# EAGLE schematic eps (EAGLE 9.6.2)

## Sheet 1 of 8: PC104 Headers
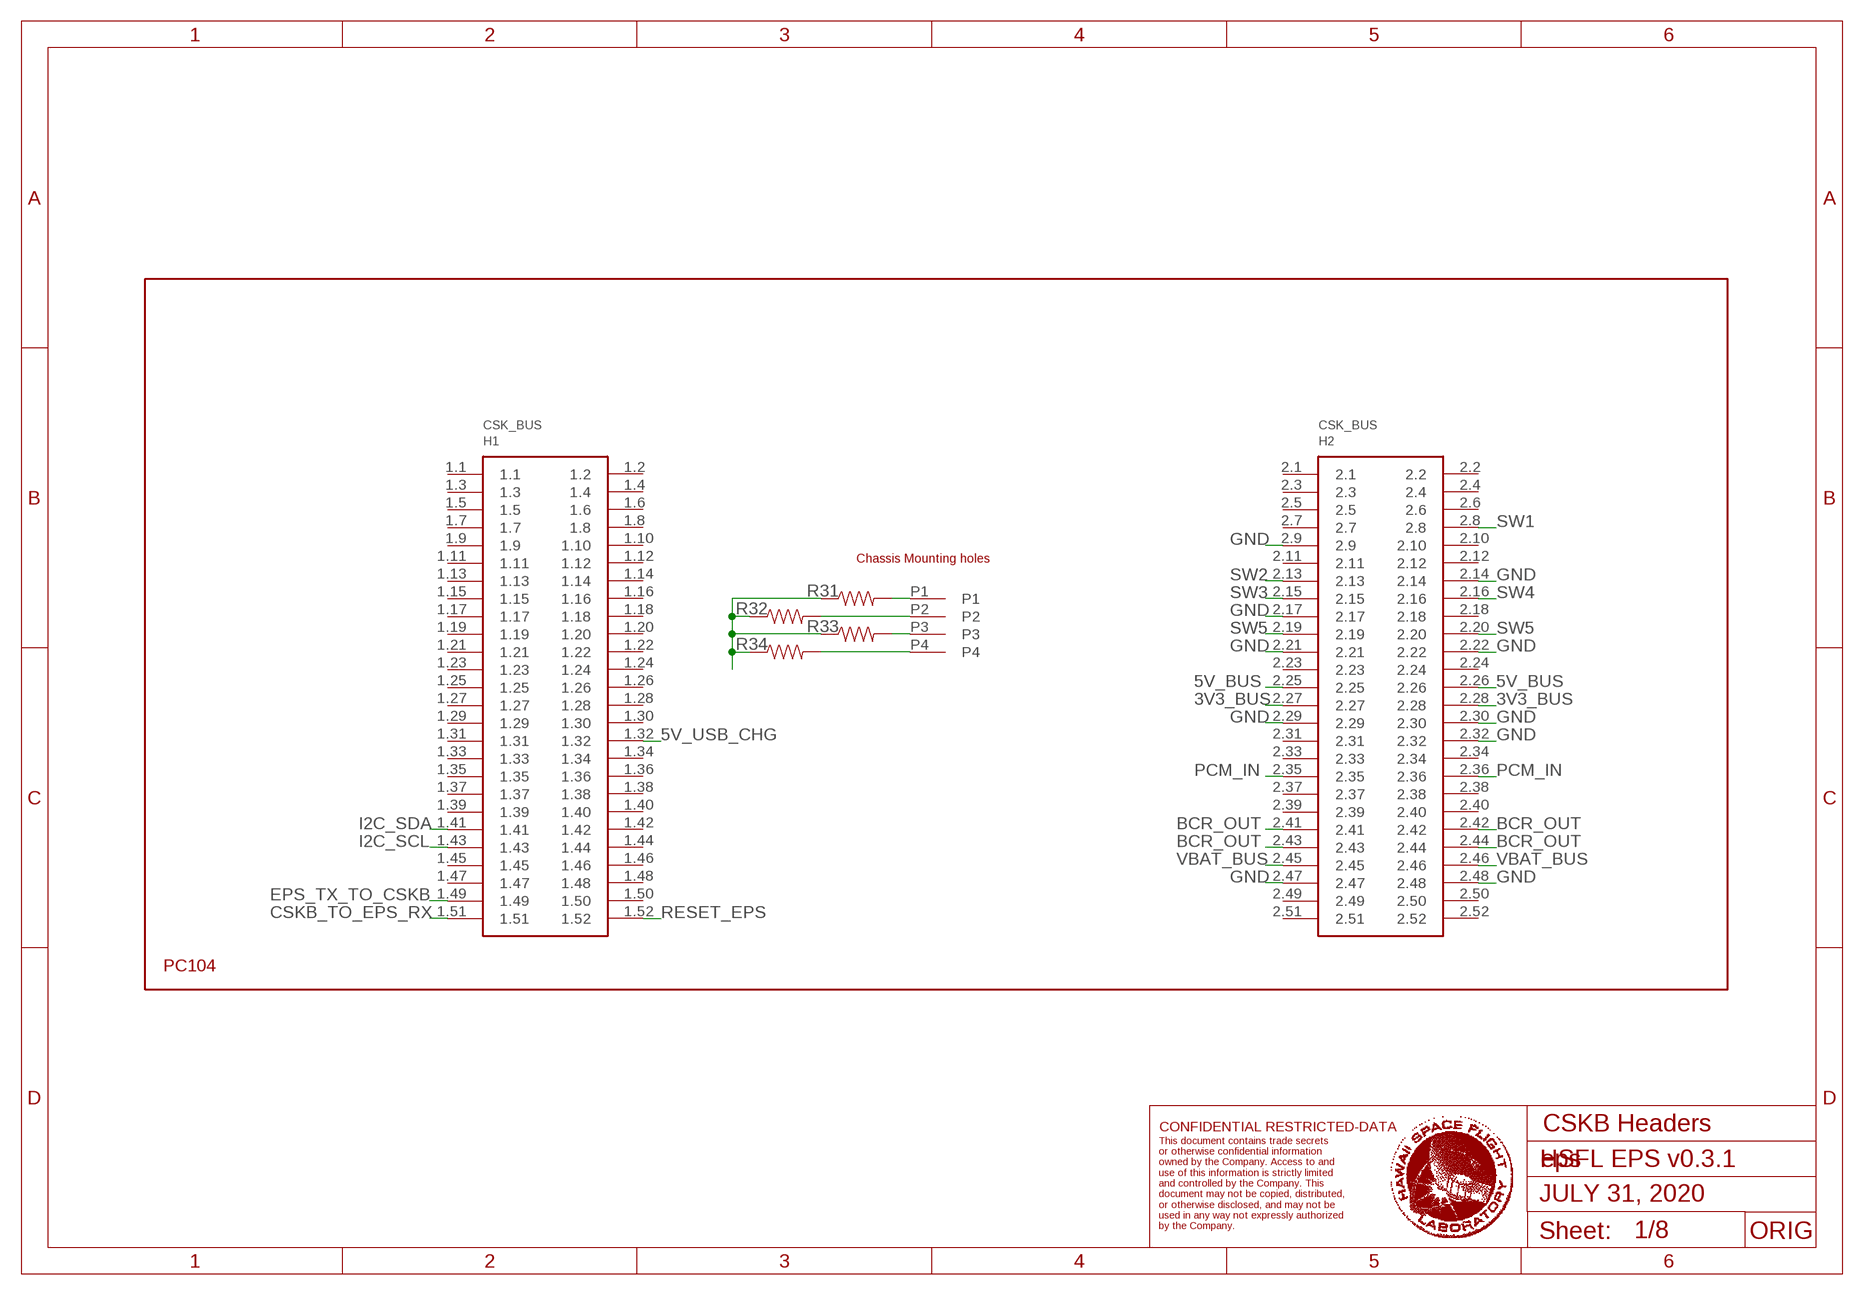
[diagram p0: schematic, sheet 1]

### Parts
H1  PC104_WCONN  [PC104_WCONN]
R31  1M  RESISTOR0805-RES  [0805]
R32  1M  RESISTOR0805-RES  [0805]
R33  1M  RESISTOR0805-RES  [0805]
R34  1M  RESISTOR0805-RES  [0805]

### Nets
3V3_BUS: H1.2.27 H1.2.28 ; also sheet 7,8
5V_BUS: H1.2.25 H1.2.26 ; also sheet 3,6,8
5V_USB_CHG: H1.1.32 ; also sheet 2
BCR_OUT: H1.2.41 H1.2.42 H1.2.43 H1.2.44 ; also sheet 2
CSKB_TO_EPS_RX: H1.1.51 ; also sheet 3
EPS_TX_TO_CSKB: H1.1.49 ; also sheet 3
GND: H1.2.9 H1.2.14 H1.2.17 H1.2.21 H1.2.22 H1.2.29 H1.2.30 H1.2.32 H1.2.47 H1.2.48 R31.1 R32.1 R33.1 R34.1 ; also sheet 2,3,4,5,6,7,8
I2C_SCL: H1.1.43 ; also sheet 3
I2C_SDA: H1.1.41 ; also sheet 3
P1_R31: H1.P1 R31.2
P2_R32: H1.P2 R32.2
P3_R33: H1.P3 R33.2
P4_R34: H1.P4 R34.2
PCM_IN: H1.2.35 H1.2.36 ; also sheet 4
RESET_EPS: H1.1.52 ; also sheet 3
SW1: H1.2.8 ; also sheet 5
SW2: H1.2.13 ; also sheet 8
SW3: H1.2.15 ; also sheet 8
SW4: H1.2.16 ; also sheet 8
SW5: H1.2.19 H1.2.20 ; also sheet 8
VBAT_BUS: H1.2.45 H1.2.46 ; also sheet 8
Unconnected: H1.1.1 H1.1.2 H1.1.3 H1.1.4 H1.1.5 H1.1.6 H1.1.7 H1.1.8 H1.1.9 H1.1.10 H1.1.11 H1.1.12 H1.1.13 H1.1.14 H1.1.15 H1.1.16 H1.1.17 H1.1.18 H1.1.19 H1.1.20 H1.1.21 H1.1.22 H1.1.23 H1.1.24 H1.1.25 H1.1.26 H1.1.27 H1.1.28 H1.1.29 H1.1.30 H1.1.31 H1.1.33 H1.1.34 H1.1.35 H1.1.36 H1.1.37 H1.1.38 H1.1.39 H1.1.40 H1.1.42 H1.1.44 H1.1.45 H1.1.46 H1.1.47 H1.1.48 H1.1.50 H1.2.1 H1.2.2 H1.2.3 H1.2.4 H1.2.5 H1.2.6 H1.2.7 H1.2.10 H1.2.11 H1.2.12 H1.2.18 H1.2.23 H1.2.24 H1.2.31 H1.2.33 H1.2.34 H1.2.37 H1.2.38 H1.2.39 H1.2.40 H1.2.49 H1.2.50 H1.2.51 H1.2.52

### Notes on the sheet
- CONFIDENTIAL RESTRICTED-DATA | CSKB Headers
- HSFL EPS v0.3.1
- JULY 31, 2020
- This document contains trade secrets 
  or otherwise confidential information 
  owned by the Company. Access to and 
  use of this information is strictly limited 
  and controlled by the Company. This 
  document may not be copied, distributed, 
  or otherwise disclosed, and may not be 
  used in any way not expressly authorized 
  by the Company.
- ORIG

## Sheet 2 of 8: BCR
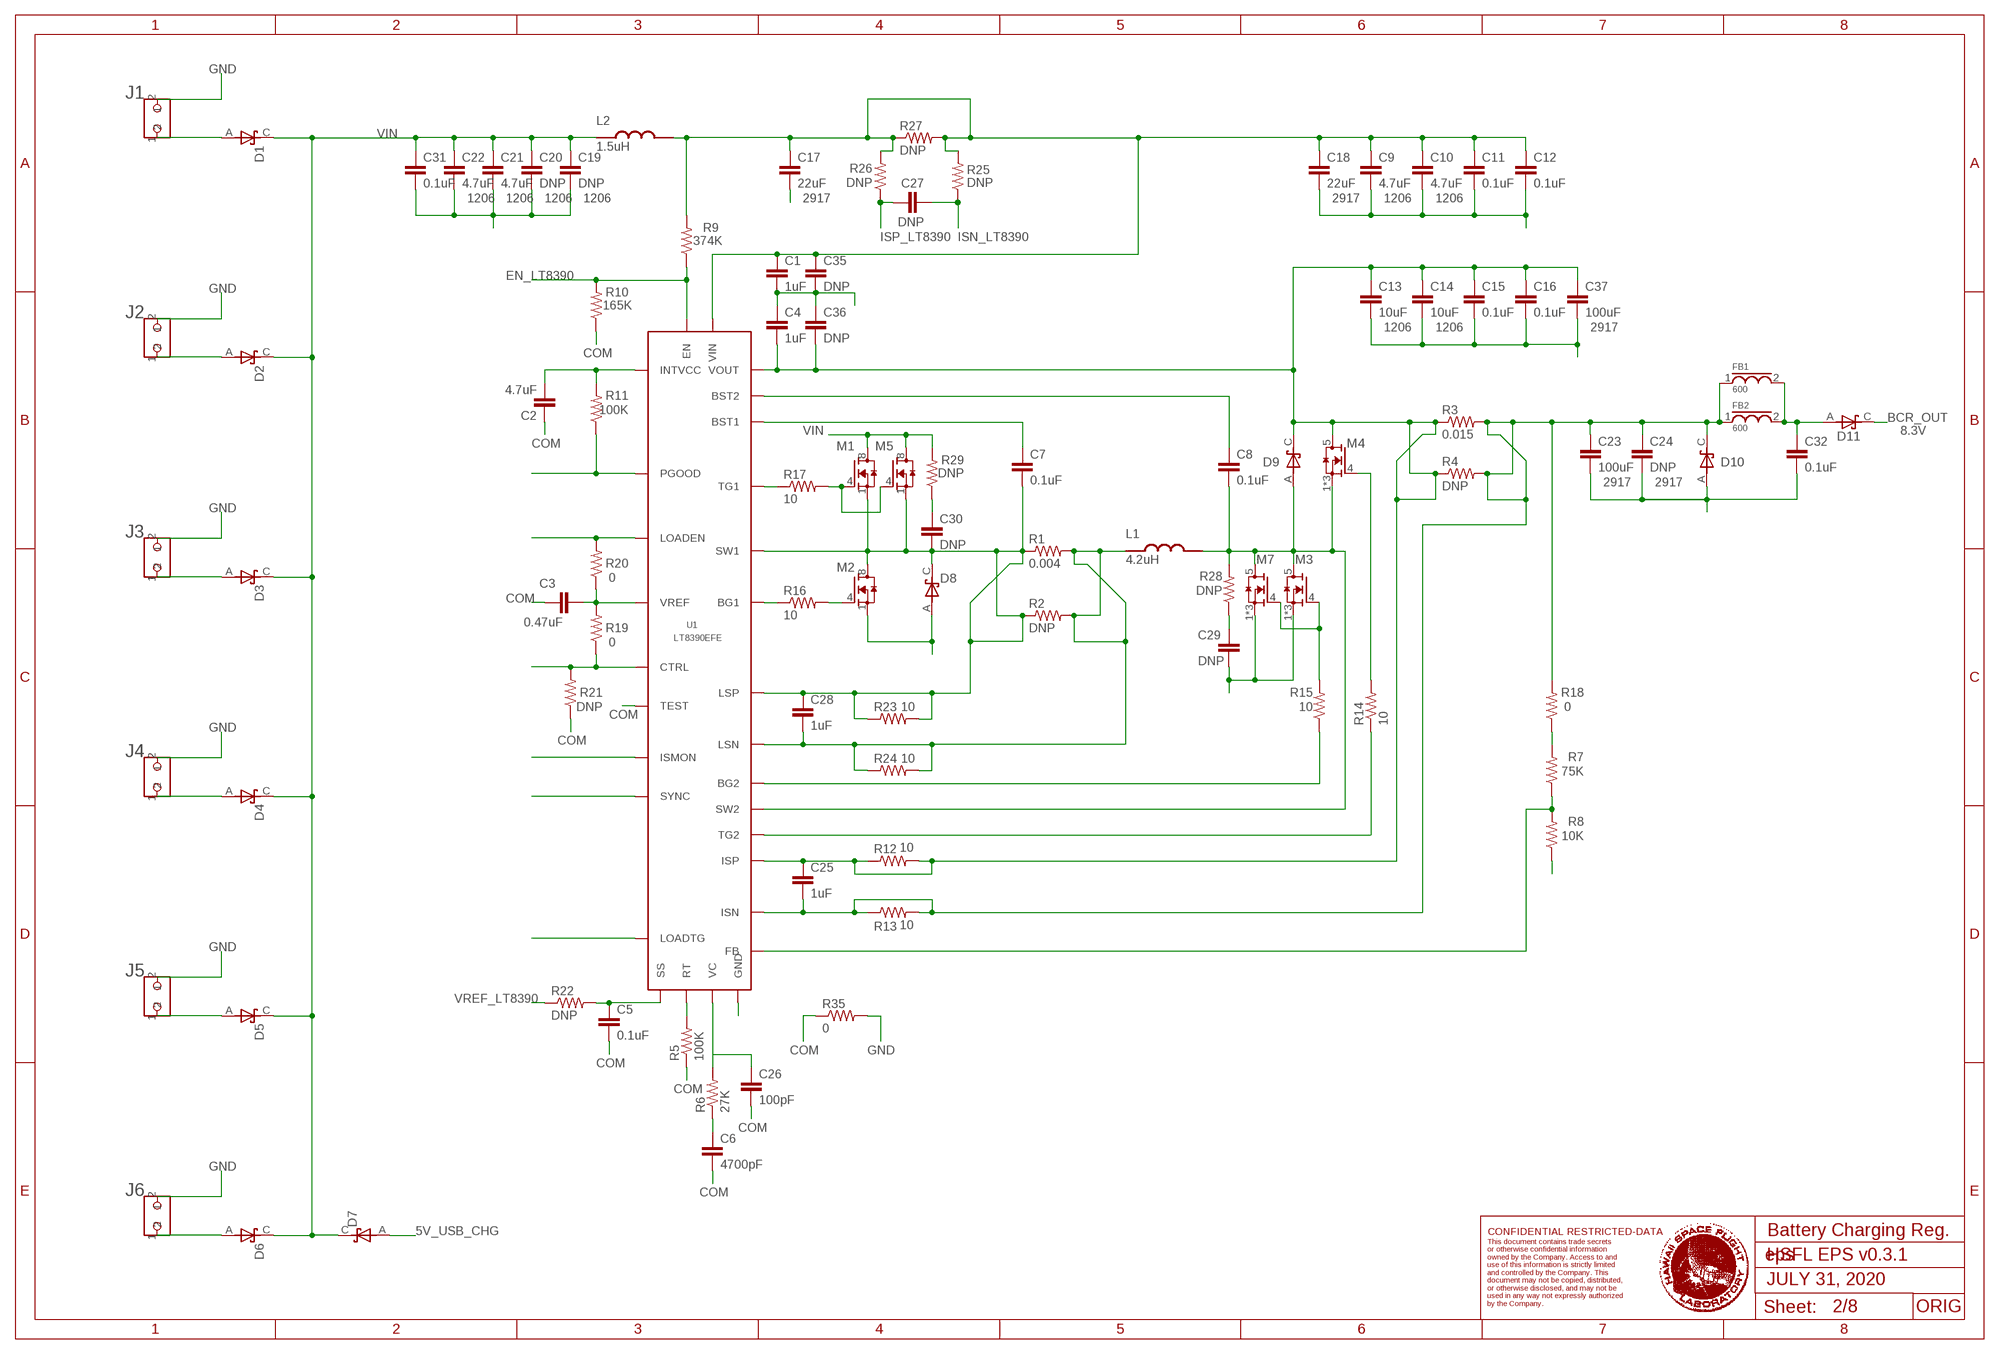
[diagram p1: schematic, sheet 2]

### Parts
C1  1uF  CAP0805  [0805]
C2  4.7uF  CAP0805  [0805]
C3  0.47uF  CAP0805  [0805]
C4  1uF  CAP0805  [0805]
C5  0.1uF  CAP0805  [0805]
C6  4700pF  CAP0805  [0805]
C7  0.1uF  CAP0805  [0805]
C8  0.1uF  CAP0805  [0805]
C9  4.7uF  CAP1206  [1206]
C10  4.7uF  CAP1206  [1206]
C11  0.1uF  CAP0805  [0805]
C12  0.1uF  CAP0805  [0805]
C13  10uF  CAP1206  [1206]
C14  10uF  CAP1206  [1206]
C15  0.1uF  CAP1210  [1210]
C16  0.1uF  CAP1210  [1210]
C17  22uF  CAP_29172917  [CAPMP7343X430N]
C18  22uF  CAP_29172917  [CAPMP7343X430N]
C19  DNP  CAP1206  [1206]
C20  DNP  CAP1206  [1206]
C21  4.7uF  CAP1206  [1206]
C22  4.7uF  CAP1206  [1206]
C23  100uF  CAP_29172917  [CAPMP7343X430N]
C24  DNP  CAP_29172917  [CAPMP7343X430N]
C25  1uF  CAP0805  [0805]
C26  100pF  CAP0805  [0805]
C27  DNP  CAP0805  [0805]
C28  1uF  CAP0805  [0805]
C29  DNP  CAP0805  [0805]
C30  DNP  CAP0805  [0805]
C31  0.1uF  CAP0805  [0805]
C32  0.1uF  CAP0805  [0805]
C35  DNP  CAP1210  [1210]
C36  DNP  CAP1210  [1210]
C37  100uF  CAP_29172917  [CAPMP7343X430N]
D1  DNP  MBR2H100SFT3G  [SODFL3616X98N]
D2  DNP  MBR2H100SFT3G  [SODFL3616X98N]
D3  DNP  MBR2H100SFT3G  [SODFL3616X98N]
D4  DNP  MBR2H100SFT3G  [SODFL3616X98N]
D5  DNP  MBR2H100SFT3G  [SODFL3616X98N]
D6  DNP  MBR2H100SFT3G  [SODFL3616X98N]
D7  DNP  MBR2H100SFT3G  [SODFL3616X98N]
D8  DNP  MBR2H100SFT3G  [SODFL3616X98N]
D9  DNP  MBR2H100SFT3G  [SODFL3616X98N]
D10  DNP  MBR2H100SFT3G  [SODFL3616X98N]
D11  DNP  MBR2H100SFT3G  [SODFL3616X98N]
FB1  600  FB_1206  [1206]
FB2  600  FB_1206  [1206]
J1  2PIN_HEADER  [2MM_2PIN_HEADER]
J2  2PIN_HEADER  [2MM_2PIN_HEADER]
J3  2PIN_HEADER  [2MM_2PIN_HEADER]
J4  2PIN_HEADER  [2MM_2PIN_HEADER]
J5  2PIN_HEADER  [2MM_2PIN_HEADER]
J6  2PIN_HEADER  [2MM_2PIN_HEADER]
L1  4.2uH  INDUCTOR_744325420  [WE-HCI_105023]
L2  1.5uH  INDUCTOR744314150  [WE-HCI_7030/7040/705023]
M1  BSC014N04LSIBSC014N04LSI  [TRANS_BSC014N04LSIATMA1]
M2  BSC014N04LSIBSC014N04LSI  [TRANS_BSC014N04LSIATMA1]
M3  BSC093N04LS51  [MOSFET_BSC093N04LSGATMA1]
M4  BSC093N04LS51  [MOSFET_BSC093N04LSGATMA1]
M5  BSC014N04LSIBSC014N04LSI  [TRANS_BSC014N04LSIATMA1]
M7  BSC093N04LS51  [MOSFET_BSC093N04LSGATMA1]
R1  0.004  KRL2012E-M-R004-F-T5  [RESC2012X70N]
R2  DNP  KRL2012E-M-R004-F-T5  [RESC2012X70N]
R3  0.015  KRL2012E-M-R004-F-T5  [RESC2012X70N]
R4  DNP  KRL2012E-M-R004-F-T5  [RESC2012X70N]
R5  100K  RESISTOR0805-RES  [0805]
R6  27K  RESISTOR0805-RES  [0805]
R7  75K  RESISTOR0805-RES  [0805]
R8  10K  RESISTOR0805-RES  [0805]
R9  374K  RESISTOR0805-RES  [0805]
R10  165K  RESISTOR0805-RES  [0805]
R11  100K  RESISTOR0805-RES  [0805]
R12  10  RESISTOR0805-RES  [0805]
R13  10  RESISTOR0805-RES  [0805]
R14  10  RESISTOR0805-RES  [0805]
R15  10  RESISTOR0805-RES  [0805]
R16  10  RESISTOR0805-RES  [0805]
R17  10  RESISTOR0805-RES  [0805]
R18  0  RESISTOR0805-RES  [0805]
R19  0  RESISTOR0805-RES  [0805]
R20  0  RESISTOR0805-RES  [0805]
R21  DNP  RESISTOR0805-RES  [0805]
R22  DNP  RESISTOR0805-RES  [0805]
R23  10  RESISTOR0805-RES  [0805]
R24  10  RESISTOR0805-RES  [0805]
R25  DNP  RESISTOR0805-RES  [0805]
R26  DNP  RESISTOR0805-RES  [0805]
R27  DNP  KRL2012E-M-R004-F-T5  [RESC2012X70N]
R28  DNP  RESISTOR0805-RES  [0805]
R29  DNP  RESISTOR0805-RES  [0805]
R35  0  RESISTOR1206  [1206]
U1  LT8390EFE  [SOP65P640X120-29N]

### Nets
5V_USB_CHG: D7.A ; also sheet 1
BCR_OUT: D11.C ; also sheet 1
BG1_LT8390: R16.1 U1.1(BG1)
BG2_LT8390: R15.1 U1.28(BG2)
BST1_LT8390: C7.1 U1.2(BST1)
BST2_LT8390: C8.2 U1.27(BST2)
COM: C2.1 C3.1 C5.2 C6.2 C26.2 R5.1 R10.1 R21.1 R35.1 U1.10(TEST)
CTRL_LT8390: R19.1 R21.2 U1.13(CTRL)
EN_LT8390: R9.1 R10.2 U1.9(EN)
FB_LT8390: R7.1 R8.2 U1.19(FB)
GND: C1.2 C4.1 C9.2 C10.2 C11.2 C12.2 C13.2 C14.2 C15.2 C16.2 C17.2 C18.2 C19.2 C20.2 C21.2 C22.2 C23.2 C24.2 C29.2 C31.2 C32.2 C35.2 C36.1 C37.2 D8.A D10.A J1.2 J2.2 J3.2 J4.2 J5.2 J6.2 M2.1(S) M3.1(S) M3.2(S) M3.3(S) M7.1(S) M7.2(S) M7.3(S) R8.1 R35.2 U1.22(SYNC) U1.29(GND) ; also sheet 1,3,4,5,6,7,8
INTVCC_LT8390: C2.2 R11.2 U1.8(INTVCC)
ISMON_LT8390: U1.16(ISMON)
ISN_LT8390: C23.1 C24.1 C25.2 C27.2 D10.C FB1.1 FB2.1 R3.2 R4.2 R13.1 R13.2 R18.2 R25.1 U1.15(ISN)
ISP_LT8390: C4.2 C13.1 C14.1 C15.1 C16.1 C25.1 C27.1 C36.2 C37.1 D9.C M4.5(D) R3.1 R4.1 R12.1 R12.2 R26.1 U1.14(ISP) U1.24(VOUT)
LOADEN_LT8390: R20.2 U1.11(LOADEN)
LOADTG_LT8390: U1.23(LOADTG)
LSN_LT8390: C28.2 L1.1 R1.2 R2.2 R24.1 R24.2 U1.6(LSN)
LSP_LT8390: C7.2 C28.1 C30.2 D8.C M1.1(S) M2.8(D) M5.1(S) R1.1 R2.1 R23.1 R23.2 U1.3(SW1) U1.5(LSP)
M1_M5_GATE: M1.4(G) M5.4(G) R17.2
M2_GATE: M2.4(G) R16.2
M3_M7_GATE: M3.4(G) M7.4(G) R15.2
M4_GATE: M4.4(G) R14.2
PGOOD_LT8390: R11.1 U1.17(PGOOD)
R28_C29: C29.1 R28.1
R29_C30: C30.1 R29.1
RT_LT8390: R5.2 U1.21(RT)
SA1AIN: D1.A J1.1
SA1BIN: D2.A J2.1
SA2AIN: D3.A J3.1
SA2BIN: D4.A J4.1
SA3AIN: D5.A J5.1
SA3BIN: D6.A J6.1
SS_LT8390: C5.1 R22.2 U1.18(SS)
SW2_LT8390: C8.1 D9.A L1.2 M3.5(D) M4.1(S) M4.2(S) M4.3(S) M7.5(D) R28.2 U1.26(SW2)
TG1_LT8390: R17.1 U1.4(TG1)
TG2_LT8390: R14.1 U1.25(TG2)
VC_2_LT8390: C6.1 R6.1
VC_LT8390: C26.1 R6.2 U1.20(VC)
VIN: C19.1 C20.1 C21.1 C22.1 C31.1 D1.C D2.C D3.C D4.C D5.C D6.C D7.C L2.1
VIN_LT8390: C1.1 C9.1 C10.1 C11.1 C12.1 C17.1 C18.1 C35.1 L2.2 M1.8(D) M5.8(D) R9.2 R25.2 R26.2 R27.1 R27.2 R29.2 U1.7(VIN)
VOUT: C32.1 D11.A FB1.2 FB2.2
VOUT_TO_FB_LT8390: R7.2 R18.1
VREF_LT8390: C3.2 R19.2 R20.1 R22.1 U1.12(VREF)

### Notes on the sheet
- 1206 | 1206 | 1206 | 1206 | 2917 | 2917 | 1206 | 1206
- 1206 | 1206 | 2917
- VIN | 8.3V
- 2917 | 2917
- CONFIDENTIAL RESTRICTED-DATA | Battery Charging Reg.
- HSFL EPS v0.3.1
- JULY 31, 2020
- This document contains trade secrets 
  or otherwise confidential information 
  owned by the Company. Access to and 
  use of this information is strictly limited 
  and controlled by the Company. This 
  document may not be copied, distributed, 
  or otherwise disclosed, and may not be 
  used in any way not expressly authorized 
  by the Company.
- ORIG

## Sheet 3 of 8: MicroController
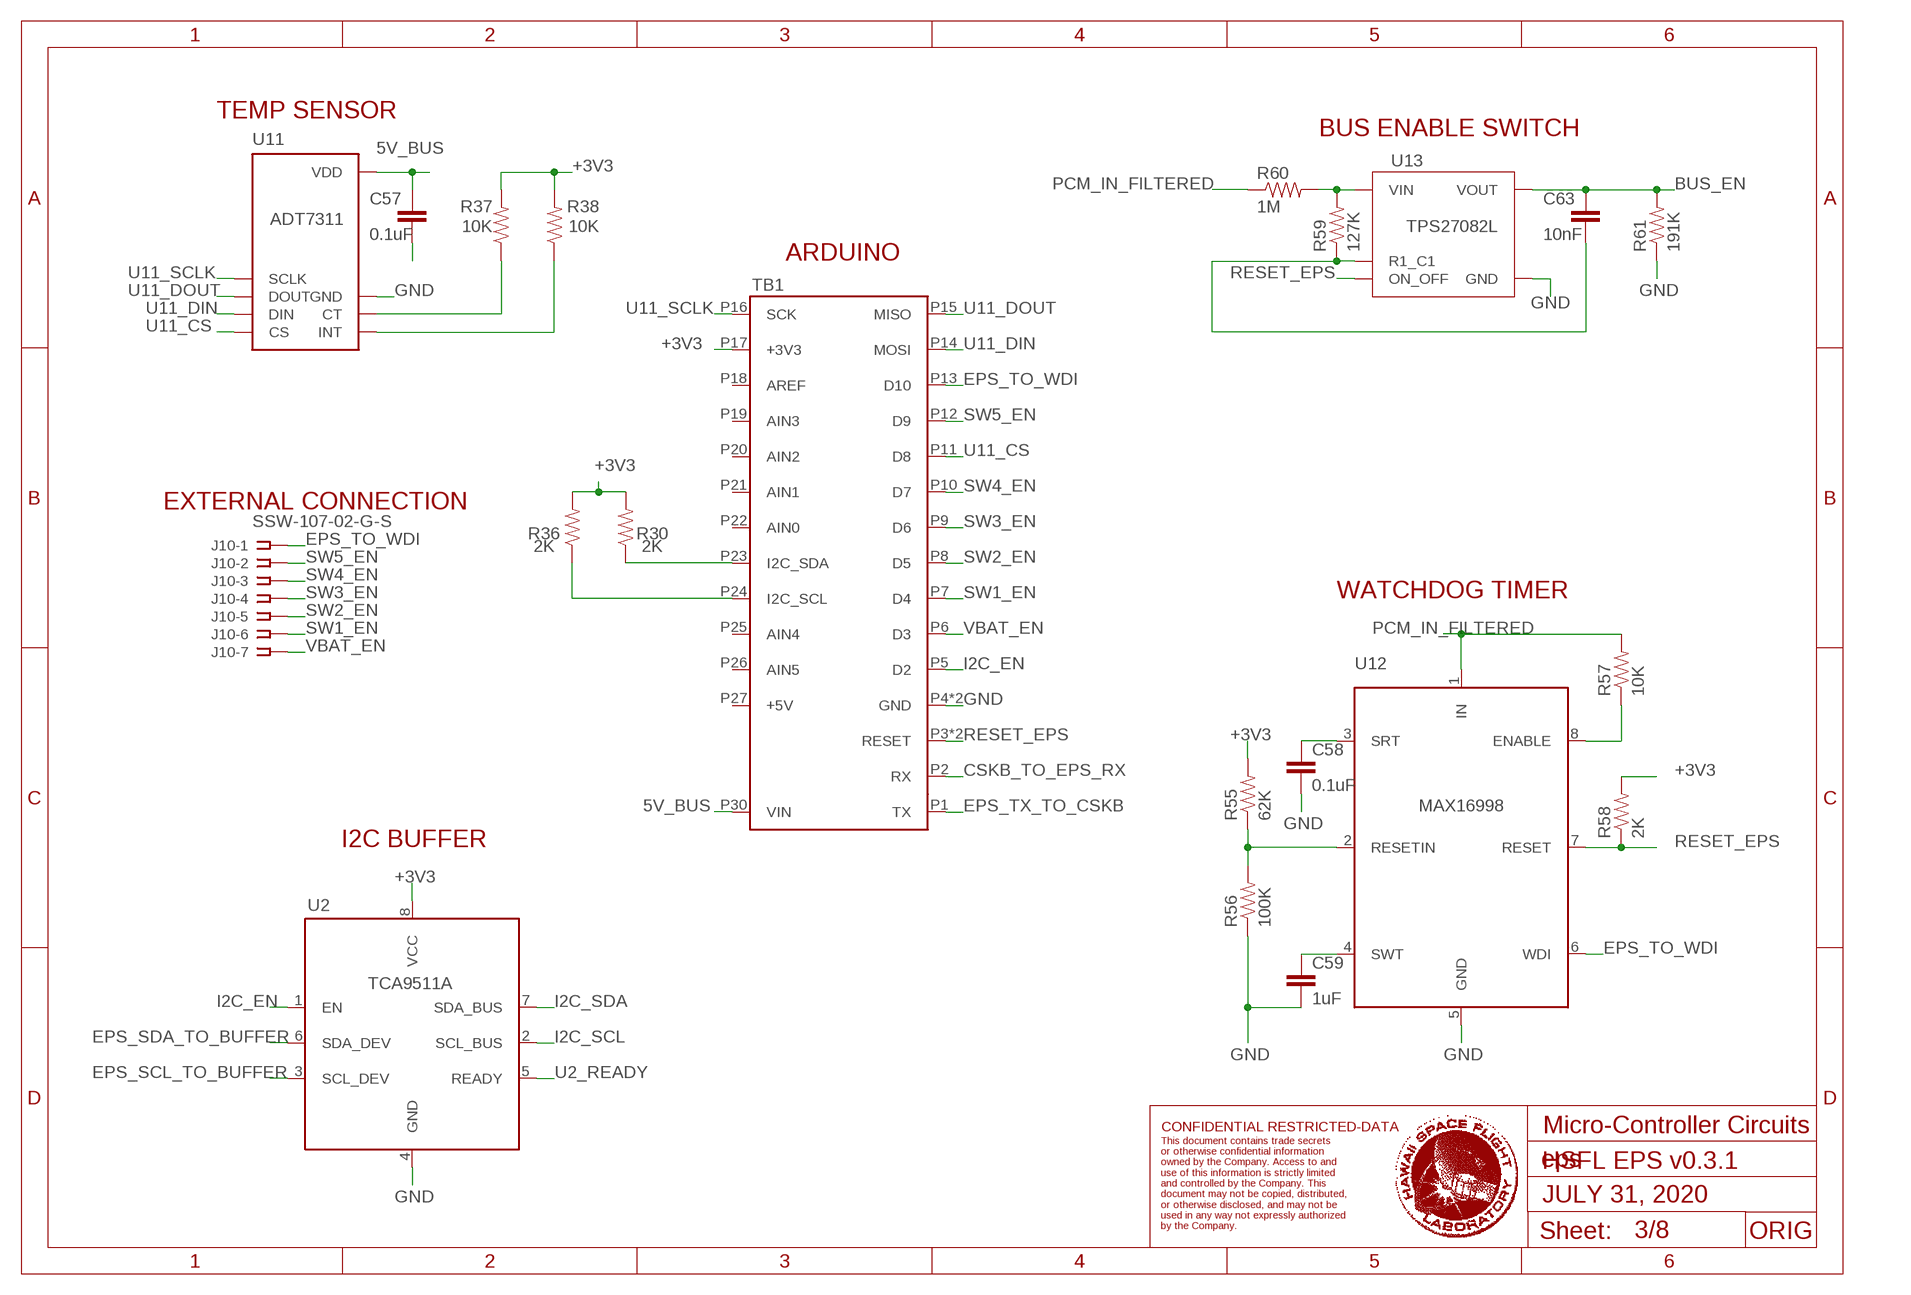
[diagram p2: schematic, sheet 3]

### Parts
C57  0.1uF  CAP0805  [0805]
C58  0.1uF  CAP0805  [0805]
C59  1uF  CAP0805  [0805]
C63  10nF  CAP0805  [0805]
J10  SSW-107-02-G-S  [SSW-107-02-G-S]
R30  2K  RESISTOR0805-RES  [0805]
R36  2K  RESISTOR0805-RES  [0805]
R37  10K  RESISTOR0805-RES  [0805]
R38  10K  RESISTOR0805-RES  [0805]
R55  62K  RESISTOR0805-RES  [0805]
R56  100K  RESISTOR0805-RES  [0805]
R57  10K  RESISTOR0805-RES  [0805]
R58  2K  RESISTOR0805-RES  [0805]
R59  127K  RESISTOR0805-RES  [0805]
R60  1M  RESISTOR0805-RES  [0805]
R61  191K  RESISTOR0805-RES  [0805]
TB1  ARDUINO_NANO  [SHIELD_ARDUINO_NANO]
U2  TCA9511A  [SOP65P490X110-8N]
U11  ADT7311  [SOIC-8]
U12  MAX16998AAUA+  [21-0036K_MXM]
U13  Value  TPS27082LDDCR  [DDC0006A_N]

### Nets
5V_BUS: C57.1 TB1.P30(VIN) U11.8(VDD) ; also sheet 1,6,8
+3V3: R30.2 R36.2 R37.2 R38.2 R55.2 R58.2 TB1.P17(+3V3) U2.8(VCC)
BUS_EN: C63.1 R61.2 U13.2(VOUT) U13.3(VOUT) ; also sheet 6,7
CSKB_TO_EPS_RX: TB1.P2(RX) ; also sheet 1
EPS_SCL_TO_BUFFER: R36.1 TB1.P24(I2C_SCL) U2.3(SCL_DEV)
EPS_SDA_TO_BUFFER: R30.1 TB1.P23(I2C_SDA) U2.6(SDA_DEV)
EPS_TO_WDI: J10.1 TB1.P13(D10) U12.6(WDI)
EPS_TX_TO_CSKB: TB1.P1(TX) ; also sheet 1
GND: C57.2 C58.2 C59.2 R56.1 R61.1 TB1.P4(GND) TB1.P29(GND) U2.4(GND) U11.7(GND) U12.5(GND) U13.1(GND) ; also sheet 1,2,4,5,6,7,8
I2C_EN: TB1.P5(D2) U2.1(EN)
I2C_SCL: U2.2(SCL_BUS) ; also sheet 1
I2C_SDA: U2.7(SDA_BUS) ; also sheet 1
PCM_IN_FILTERED: R57.2 R60.1 U12.1(IN) ; also sheet 4,5,6,7,8
PCM_IN_FILTERED_TO_BUS_EN: R59.2 R60.2 U13.4(VIN)
RESET_EPS: R58.1 TB1.P3(RESET) TB1.P28(RESET) U12.7(RESET) U13.5(ON_OFF) ; also sheet 1
SW1_EN: J10.6 TB1.P7(D4) ; also sheet 5
SW2_EN: J10.5 TB1.P8(D5) ; also sheet 8
SW3_EN: J10.4 TB1.P9(D6) ; also sheet 8
SW4_EN: J10.3 TB1.P10(D7) ; also sheet 8
SW5_EN: J10.2 TB1.P12(D9) ; also sheet 8
U2_READY: U2.5(READY)
U11_CS: TB1.P11(D8) U11.4(CS)
U11_CT: R37.1 U11.6(CT)
U11_DIN: TB1.P14(MOSI) U11.3(DIN)
U11_DOUT: TB1.P15(MISO) U11.2(DOUT)
U11_INT: R38.1 U11.5(INT)
U11_SCLK: TB1.P16(SCK) U11.1(SCLK)
U12_EN_ALT: R57.1 U12.8(ENABLE)
U12_RESETIN: R55.1 R56.2 U12.2(RESETIN)
U12_SRT: C58.1 U12.3(SRT)
U12_SWT: C59.1 U12.4(SWT)
U13_R60_C63: C63.2 R59.1 U13.6(R1_C1)
VBAT_EN: J10.7 TB1.P6(D3) ; also sheet 8
Unconnected: TB1.P18(AREF) TB1.P19(AIN3) TB1.P20(AIN2) TB1.P21(AIN1) TB1.P22(AIN0) TB1.P25(AIN4) TB1.P26(AIN5) TB1.P27(+5V)

### Notes on the sheet
- TEMP SENSOR
- BUS ENABLE SWITCH
- ARDUINO
- EXTERNAL CONNECTION
- WATCHDOG TIMER
- I2C BUFFER
- CONFIDENTIAL RESTRICTED-DATA | Micro-Controller Circuits
- HSFL EPS v0.3.1
- JULY 31, 2020
- This document contains trade secrets 
  or otherwise confidential information 
  owned by the Company. Access to and 
  use of this information is strictly limited 
  and controlled by the Company. This 
  document may not be copied, distributed, 
  or otherwise disclosed, and may not be 
  used in any way not expressly authorized 
  by the Company.
- ORIG

## Sheet 4 of 8: PCM_IN Filter
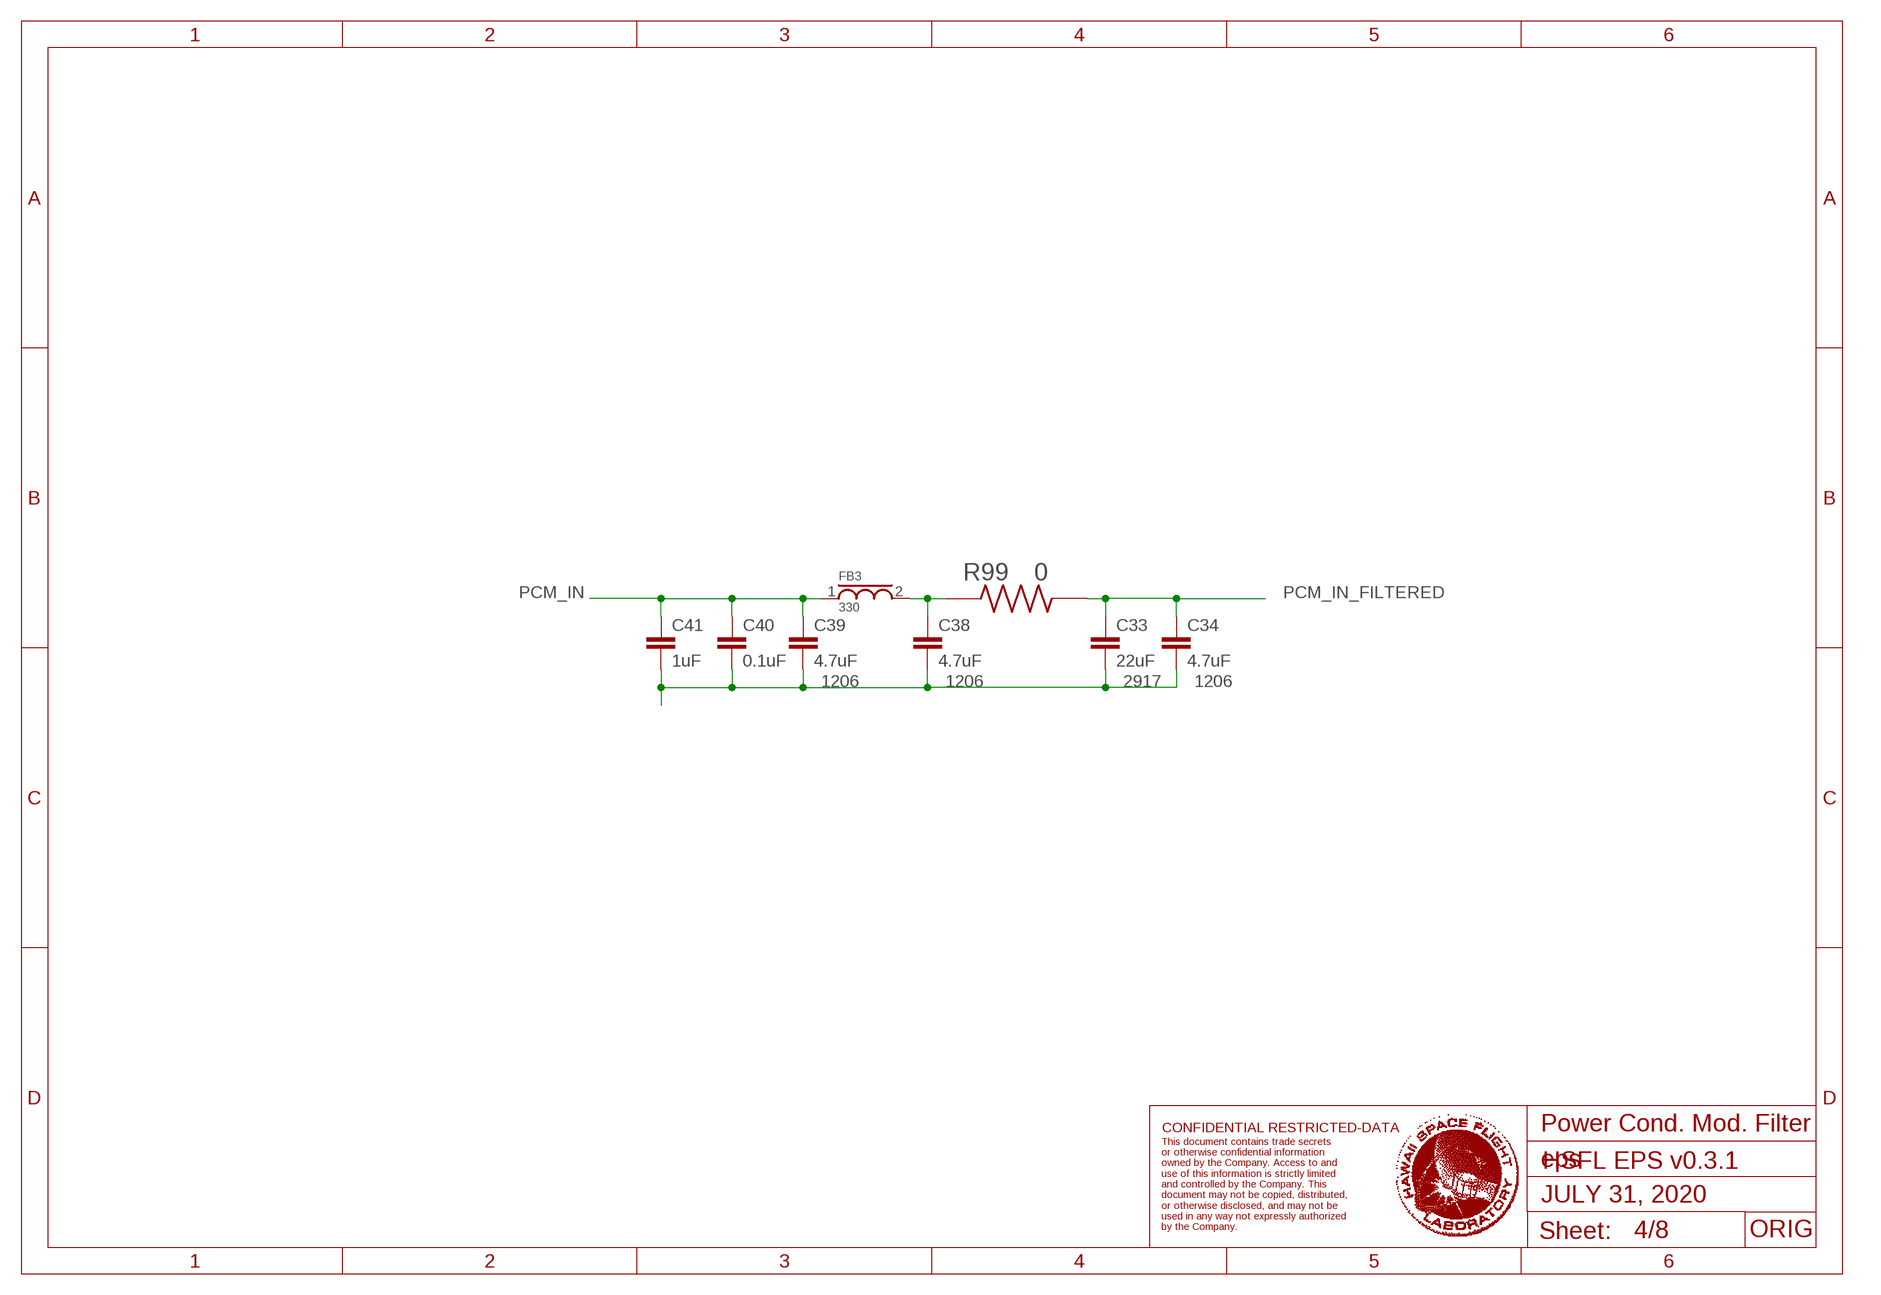
[diagram p3: schematic, sheet 4]

### Parts
C33  22uF  CAP_29172917  [CAPMP7343X430N]
C34  4.7uF  CAP1206  [1206]
C38  4.7uF  CAP1206  [1206]
C39  4.7uF  CAP1206  [1206]
C40  0.1uF  CAP0805  [0805]
C41  1uF  CAP0805  [0805]
FB3  330  FB_0805  [0805]
R99  0  CRCW20100000Z0EF  [RESC5025X70N]

### Nets
FB3_L3: C38.1 FB3.2 R99.1
GND: C33.2 C34.2 C38.2 C39.2 C40.2 C41.2 ; also sheet 1,2,3,5,6,7,8
PCM_IN: C39.1 C40.1 C41.1 FB3.1 ; also sheet 1
PCM_IN_FILTERED: C33.1 C34.1 R99.2 ; also sheet 3,5,6,7,8

### Notes on the sheet
- 1206 | 1206 | 2917 | 1206
- CONFIDENTIAL RESTRICTED-DATA | Power Cond. Mod. Filter
- HSFL EPS v0.3.1
- JULY 31, 2020
- This document contains trade secrets 
  or otherwise confidential information 
  owned by the Company. Access to and 
  use of this information is strictly limited 
  and controlled by the Company. This 
  document may not be copied, distributed, 
  or otherwise disclosed, and may not be 
  used in any way not expressly authorized 
  by the Company.
- ORIG

## Sheet 5 of 8: 5V BURN
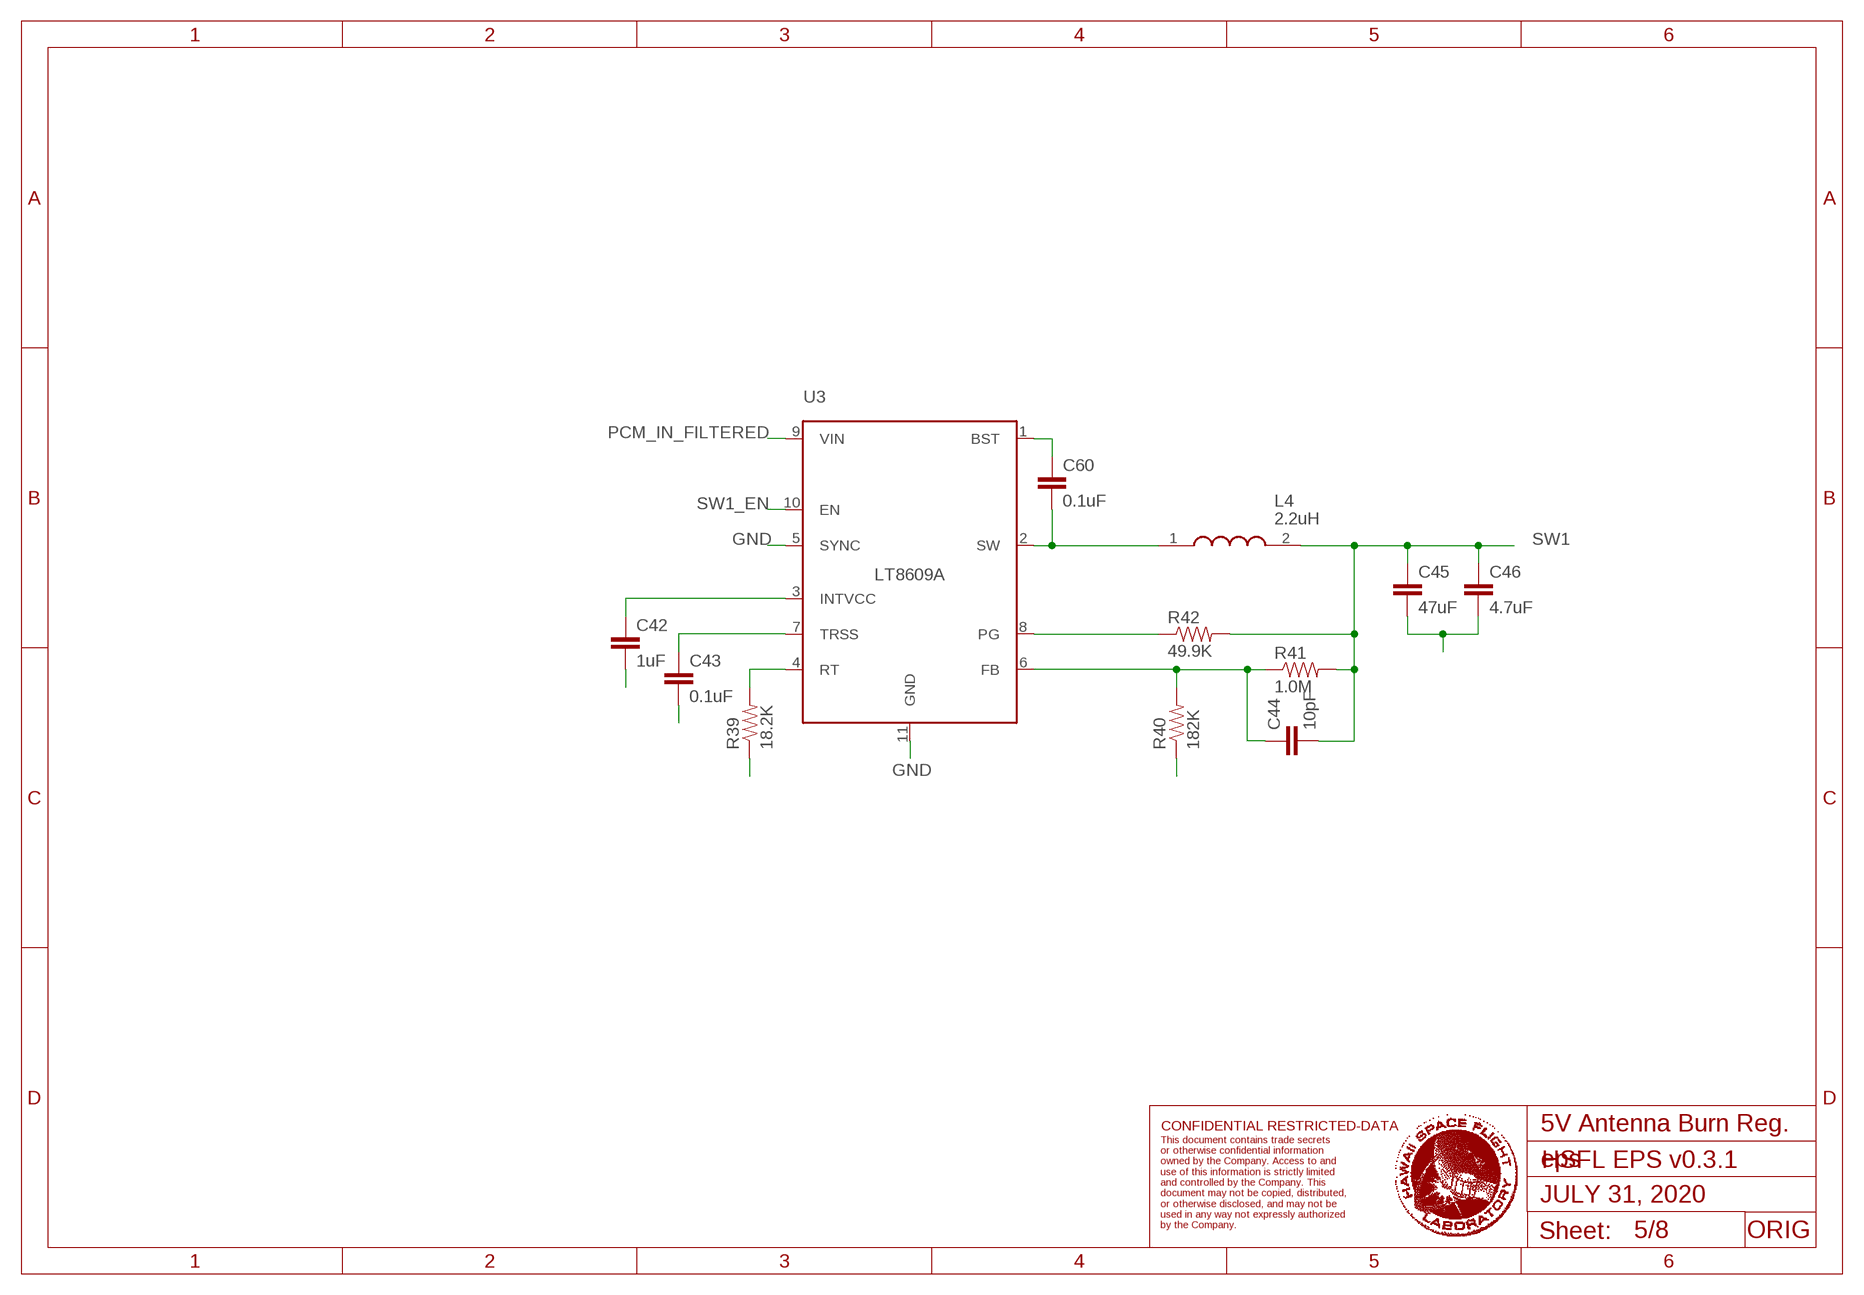
[diagram p4: schematic, sheet 5]

### Parts
C42  1uF  CAP0805  [0805]
C43  0.1uF  CAP0805  [0805]
C44  10pF  CAP0805  [0805]
C45  47uF  CAP1210  [1210]
C46  4.7uF  CAP0805  [0805]
C60  0.1uF  CAP0805  [0805]
L4  2.2uH  XFL4020-222MEC  [XFL4030472MEB]
R39  18.2K  RESISTOR0805-RES  [0805]
R40  182K  RESISTOR0805-RES  [0805]
R41  1.0M  RESISTOR0805-RES  [0805]
R42  49.9K  RESISTOR0805-RES  [0805]
U3  LT8609A  [MSOP-10_MSE]

### Nets
FB_SW1: C44.1 R40.2 R41.1 U3.6(FB)
GND: C42.2 C43.2 C45.2 C46.2 R39.1 R40.1 U3.5(SYNC) U3.11(GND) ; also sheet 1,2,3,4,6,7,8
PCM_IN_FILTERED: U3.9(VIN) ; also sheet 3,4,6,7,8
PG_SW1: R42.1 U3.8(PG)
RT_SW1: R39.2 U3.4(RT)
SW1: C44.2 C45.1 C46.1 L4.2 R41.2 R42.2 ; also sheet 1
SW1_EN: U3.10(EN) ; also sheet 3
SW_SW1: C60.2 L4.1 U3.2(SW)
TRSS_SW1: C43.1 U3.7(TRSS)
U3_BST: C60.1 U3.1(BST)
VCC_SW1: C42.1 U3.3(INTVCC)

### Notes on the sheet
- CONFIDENTIAL RESTRICTED-DATA | 5V Antenna Burn Reg.
- HSFL EPS v0.3.1
- JULY 31, 2020
- This document contains trade secrets 
  or otherwise confidential information 
  owned by the Company. Access to and 
  use of this information is strictly limited 
  and controlled by the Company. This 
  document may not be copied, distributed, 
  or otherwise disclosed, and may not be 
  used in any way not expressly authorized 
  by the Company.
- ORIG

## Sheet 6 of 8: 5V_BUS
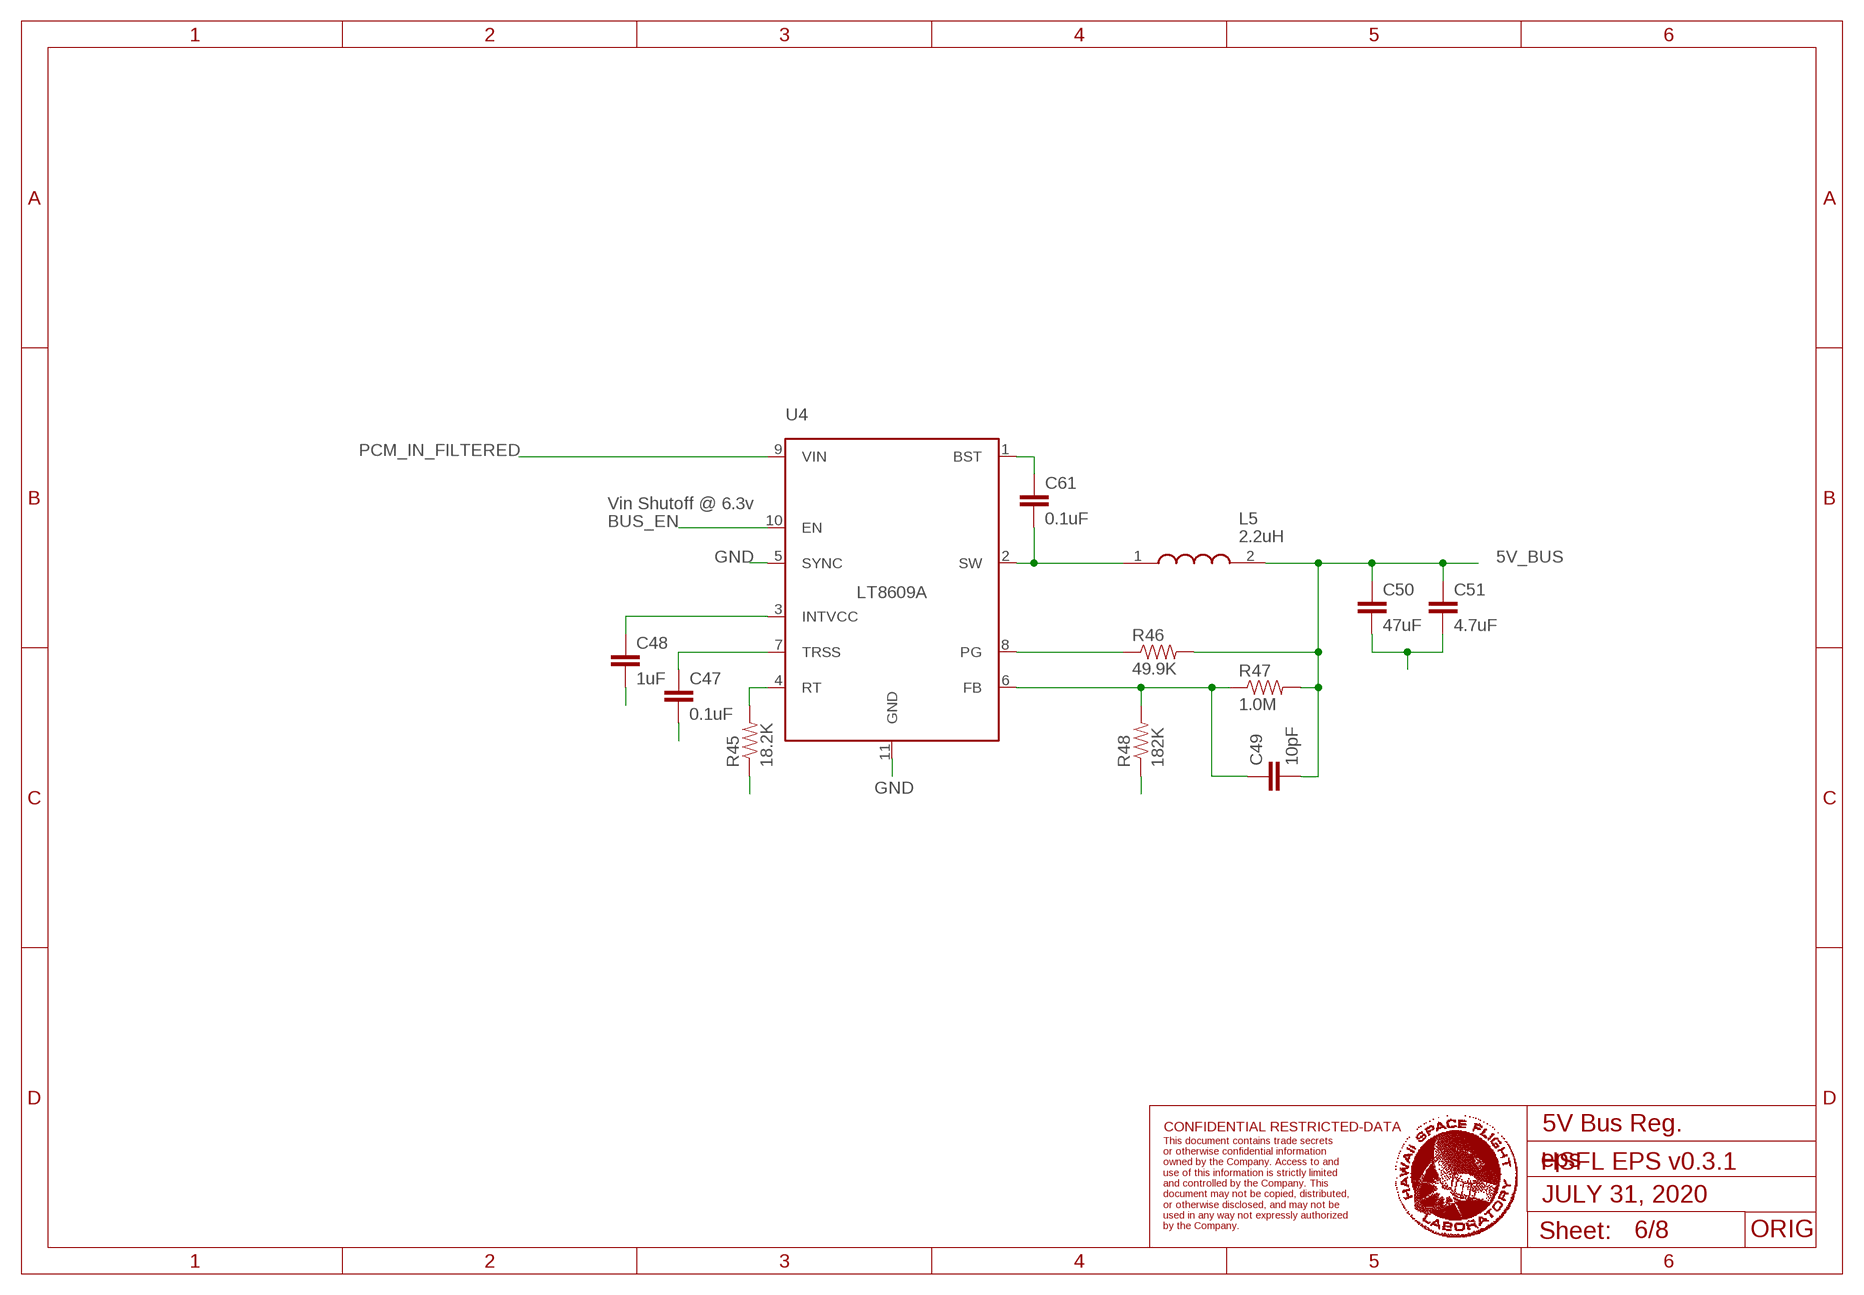
[diagram p5: schematic, sheet 6]

### Parts
C47  0.1uF  CAP0805  [0805]
C48  1uF  CAP0805  [0805]
C49  10pF  CAP0805  [0805]
C50  47uF  CAP1210  [1210]
C51  4.7uF  CAP0805  [0805]
C61  0.1uF  CAP0805  [0805]
L5  2.2uH  XFL4020-222MEC  [XFL4030472MEB]
R45  18.2K  RESISTOR0805-RES  [0805]
R46  49.9K  RESISTOR0805-RES  [0805]
R47  1.0M  RESISTOR0805-RES  [0805]
R48  182K  RESISTOR0805-RES  [0805]
U4  LT8609A  [MSOP-10_MSE]

### Nets
5V_BUS: C49.2 C50.1 C51.1 L5.2 R46.2 R47.2 ; also sheet 1,3,8
BST_5V_BUS: C61.1 U4.1(BST)
BUS_EN: U4.10(EN) ; also sheet 3,7
FB_5V_BUS: C49.1 R47.1 R48.2 U4.6(FB)
GND: C47.2 C48.2 C50.2 C51.2 R45.1 R48.1 U4.5(SYNC) U4.11(GND) ; also sheet 1,2,3,4,5,7,8
PCM_IN_FILTERED: U4.9(VIN) ; also sheet 3,4,5,7,8
PG_5V_BUS: R46.1 U4.8(PG)
RT_5V_BUS: R45.2 U4.4(RT)
SW_5V_BUS: C61.2 L5.1 U4.2(SW)
TRSS_5V_BUS: C47.1 U4.7(TRSS)
VCC_5V_BUS: C48.1 U4.3(INTVCC)

### Notes on the sheet
- Vin Shutoff @ 6.3v
- CONFIDENTIAL RESTRICTED-DATA | 5V Bus Reg.
- HSFL EPS v0.3.1
- JULY 31, 2020
- This document contains trade secrets 
  or otherwise confidential information 
  owned by the Company. Access to and 
  use of this information is strictly limited 
  and controlled by the Company. This 
  document may not be copied, distributed, 
  or otherwise disclosed, and may not be 
  used in any way not expressly authorized 
  by the Company.
- ORIG

## Sheet 7 of 8: 3V3_BUS
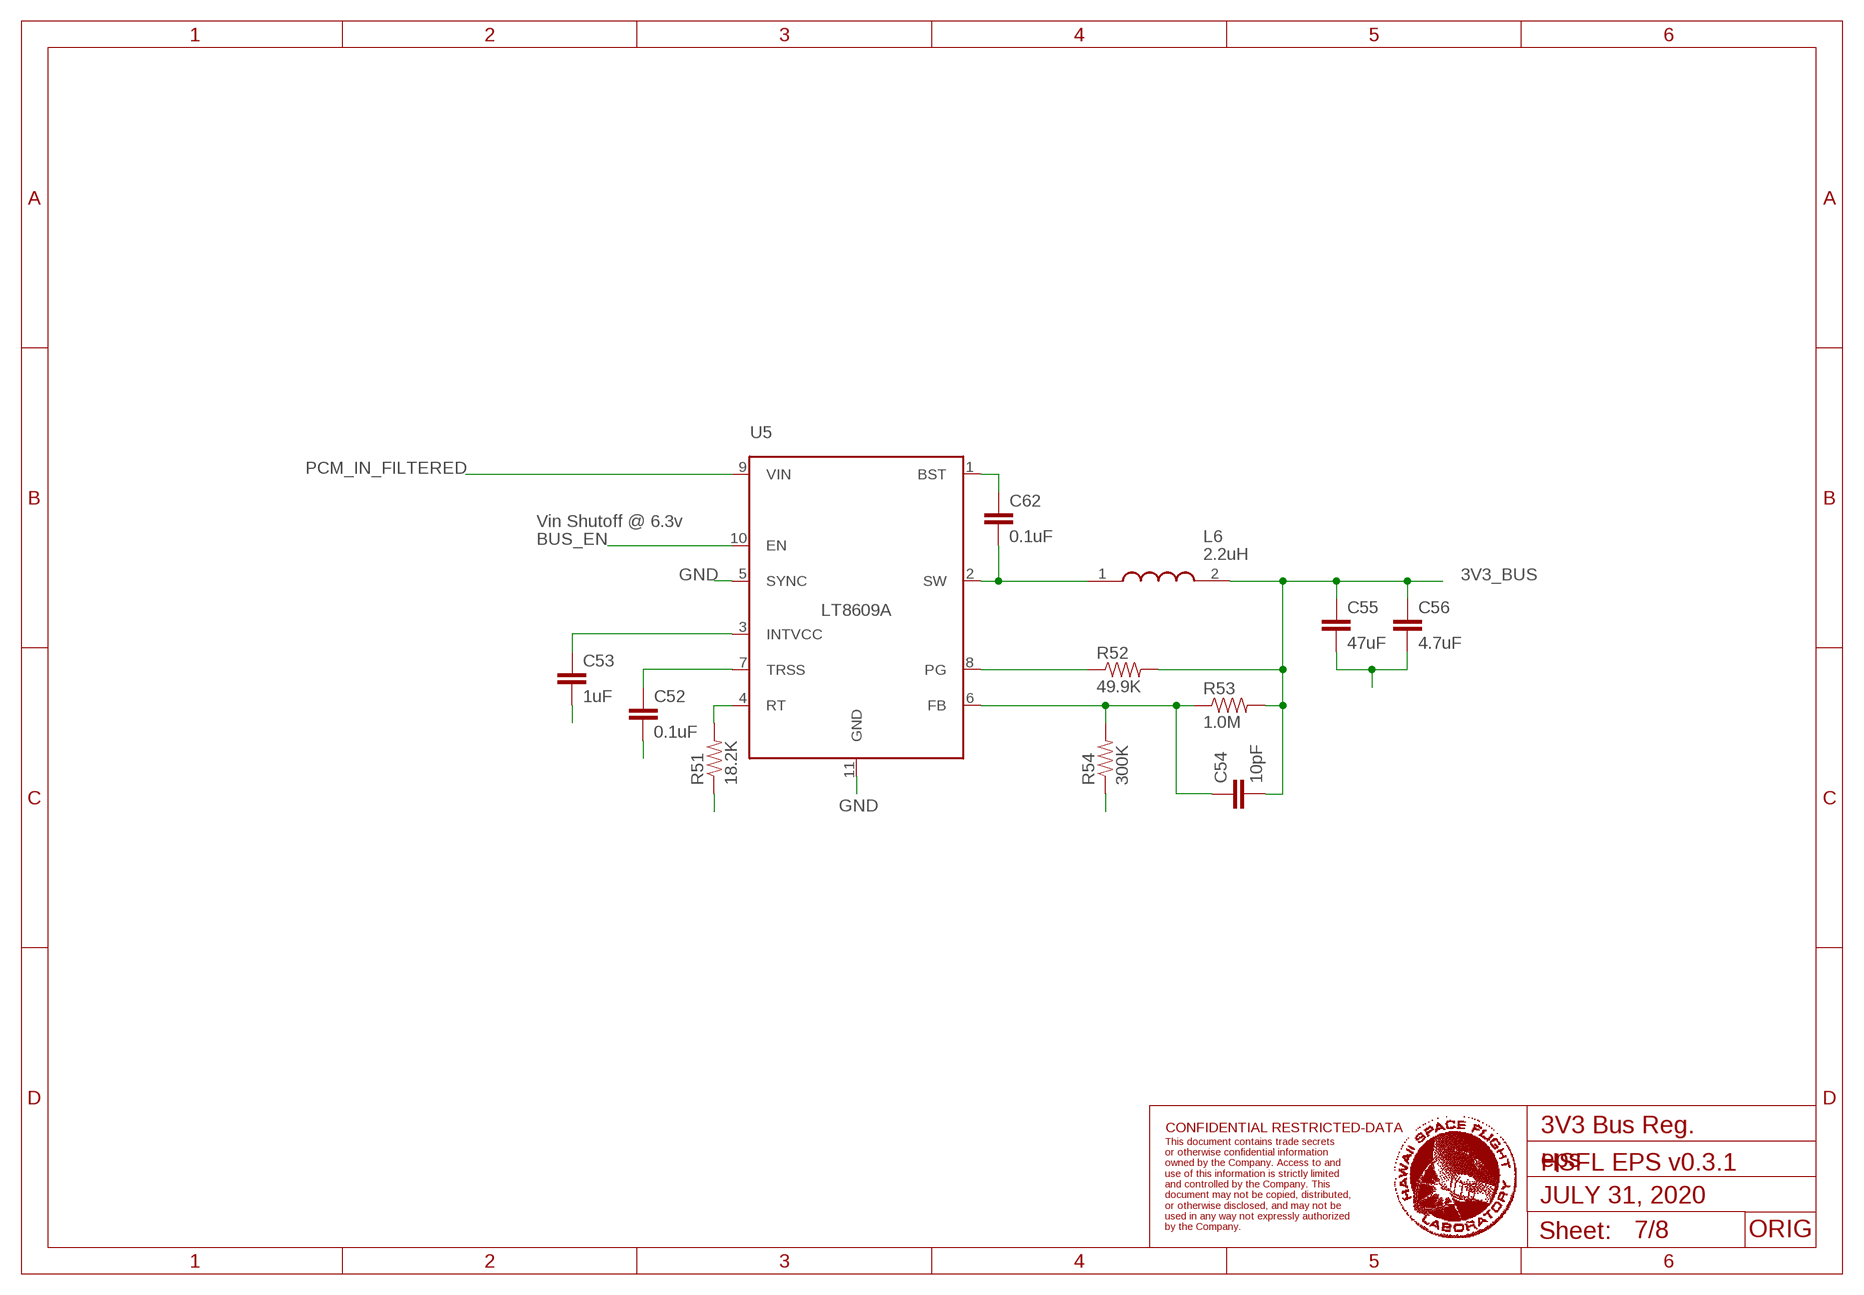
[diagram p6: schematic, sheet 7]

### Parts
C52  0.1uF  CAP0805  [0805]
C53  1uF  CAP0805  [0805]
C54  10pF  CAP0805  [0805]
C55  47uF  CAP1210  [1210]
C56  4.7uF  CAP0805  [0805]
C62  0.1uF  CAP0805  [0805]
L6  2.2uH  XFL4020-222MEC  [XFL4030472MEB]
R51  18.2K  RESISTOR0805-RES  [0805]
R52  49.9K  RESISTOR0805-RES  [0805]
R53  1.0M  RESISTOR0805-RES  [0805]
R54  300K  RESISTOR0805-RES  [0805]
U5  LT8609A  [MSOP-10_MSE]

### Nets
3V3_BUS: C54.2 C55.1 C56.1 L6.2 R52.2 R53.2 ; also sheet 1,8
BST_3V3_BUS: C62.1 U5.1(BST)
BUS_EN: U5.10(EN) ; also sheet 3,6
FB_3V3_BUS: C54.1 R53.1 R54.2 U5.6(FB)
GND: C52.2 C53.2 C55.2 C56.2 R51.1 R54.1 U5.5(SYNC) U5.11(GND) ; also sheet 1,2,3,4,5,6,8
PCM_IN_FILTERED: U5.9(VIN) ; also sheet 3,4,5,6,8
PG_3V3_BUS: R52.1 U5.8(PG)
RT_3V3_BUS: R51.2 U5.4(RT)
SW_3V3_BUS: C62.2 L6.1 U5.2(SW)
TRSS_3V3_BUS: C52.1 U5.7(TRSS)
VCC_3V3_BUS: C53.1 U5.3(INTVCC)

### Notes on the sheet
- Vin Shutoff @ 6.3v
- CONFIDENTIAL RESTRICTED-DATA | 3V3 Bus Reg.
- HSFL EPS v0.3.1
- JULY 31, 2020
- This document contains trade secrets 
  or otherwise confidential information 
  owned by the Company. Access to and 
  use of this information is strictly limited 
  and controlled by the Company. This 
  document may not be copied, distributed, 
  or otherwise disclosed, and may not be 
  used in any way not expressly authorized 
  by the Company.
- ORIG

## Sheet 8 of 8: SWITCHES
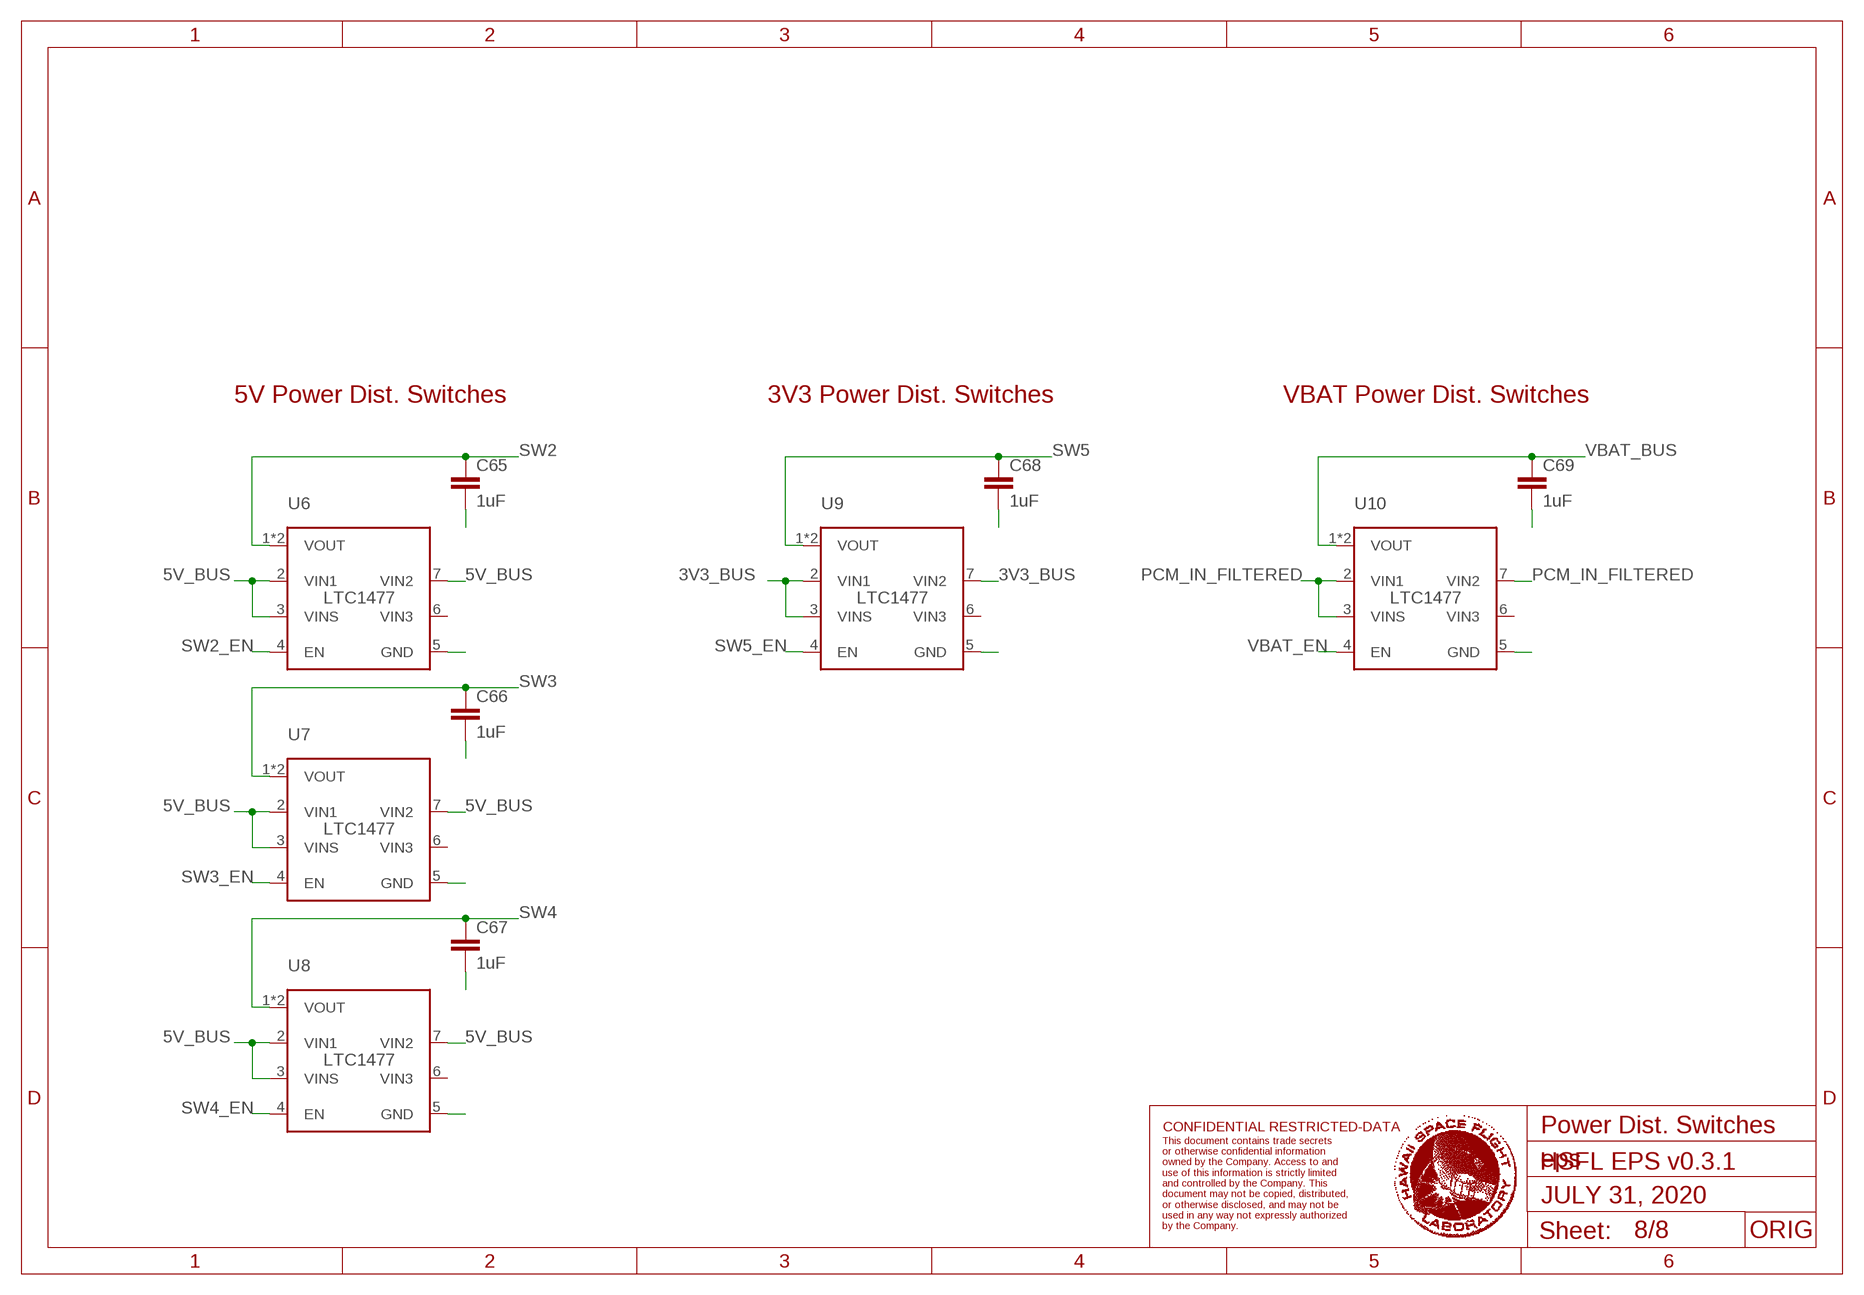
[diagram p7: schematic, sheet 8]

### Parts
C65  1uF  CAP0805  [0805]
C66  1uF  CAP0805  [0805]
C67  1uF  CAP0805  [0805]
C68  1uF  CAP0805  [0805]
C69  1uF  CAP0805  [0805]
U6  LTC1477  [SO8]
U7  LTC1477  [SO8]
U8  LTC1477  [SO8]
U9  LTC1477  [SO8]
U10  LTC1477  [SO8]

### Nets
3V3_BUS: U9.2(VIN1) U9.3(VINS) U9.7(VIN2) ; also sheet 1,7
5V_BUS: U6.2(VIN1) U6.3(VINS) U6.7(VIN2) U7.2(VIN1) U7.3(VINS) U7.7(VIN2) U8.2(VIN1) U8.3(VINS) U8.7(VIN2) ; also sheet 1,3,6
GND: C65.2 C66.2 C67.2 C68.2 C69.2 U6.5(GND) U7.5(GND) U8.5(GND) U9.5(GND) U10.5(GND) ; also sheet 1,2,3,4,5,6,7
PCM_IN_FILTERED: U10.2(VIN1) U10.3(VINS) U10.7(VIN2) ; also sheet 3,4,5,6,7
SW2: C65.1 U6.1(VOUT) U6.8(VOUT) ; also sheet 1
SW2_EN: U6.4(EN) ; also sheet 3
SW3: C66.1 U7.1(VOUT) U7.8(VOUT) ; also sheet 1
SW3_EN: U7.4(EN) ; also sheet 3
SW4: C67.1 U8.1(VOUT) U8.8(VOUT) ; also sheet 1
SW4_EN: U8.4(EN) ; also sheet 3
SW5: C68.1 U9.1(VOUT) U9.8(VOUT) ; also sheet 1
SW5_EN: U9.4(EN) ; also sheet 3
VBAT_BUS: C69.1 U10.1(VOUT) U10.8(VOUT) ; also sheet 1
VBAT_EN: U10.4(EN) ; also sheet 3
Unconnected: U6.6(VIN3) U7.6(VIN3) U8.6(VIN3) U9.6(VIN3) U10.6(VIN3)

### Notes on the sheet
- 5V Power Dist. Switches | 3V3 Power Dist. Switches | VBAT Power Dist. Switches
- CONFIDENTIAL RESTRICTED-DATA | Power Dist. Switches
- HSFL EPS v0.3.1
- JULY 31, 2020
- This document contains trade secrets 
  or otherwise confidential information 
  owned by the Company. Access to and 
  use of this information is strictly limited 
  and controlled by the Company. This 
  document may not be copied, distributed, 
  or otherwise disclosed, and may not be 
  used in any way not expressly authorized 
  by the Company.
- ORIG

## Library data of the parts
C1-C16 C19-C22 C25-C32 C34-C36 C38-C63 C65-C69 = HSFL_Main_Library:CAP: Capacitor Standard 0603 ceramic capacitor, and 0.1" leaded capacitor.
C17 C18 C23 C24 C33 C37 = HSFL_Main_Library:CAP_2917
D1-D11 = HSFL_Main_Library:MBR2H100SFT3G: MBR2H100 Series 100 V 2 A Surface Mount Schottky Power Rectifier - SOD-123F; AVAILABILITY: Unavailable; DESCRIPTION: Diode Schottky 100V 2A Surface Mount SOD-123FL; MF: ON Semiconductor; MP: MBR2H100SFT3G; PACKAGE: SOD-123 ON Semiconductor; PRICE: None
FB1 FB2 = HSFL_Main_Library:FB_
FB3 = HSFL_Main_Library:FB_0805
H1 = HSFL_Main_Library:PC104_WCONN
J1-J6 = HSFL_Main_Library:2PIN_HEADER
J10 = con-samtec:SSW-107-02-G-S: THROUGH-HOLE .025" SQ POST SOCKET Source: Samtec SSW.pdf; MF: Samtec Inc.; MPN: SSW-107-02-G-S; OC_FARNELL: unknown; OC_NEWARK: 11P9433
L1 = HSFL_Main_Library:INDUCTOR_
L2 = HSFL_Main_Library:INDUCTOR
L4-L6 = HSFL_Main_Library:XFL4020-222MEC: COILCRAFT - XFL4020-222MEC - INDUCTOR, 2.2UH, 8A, 20%, PWR, 38MHZ Source: Datasheet <https://www.coilcraft.com/pdfs/xfl4020.pdf>; ARROW_PART_NUMBER: XFL4020-222MEC; DESCRIPTION: COILCRAFT - XFL4020-222MEC - INDUCTOR, 2.2UH, 8A, 20%, PWR, 38MHZ; HEIGHT: 3mm; MANUFACTURER_NAME: COILCRAFT; MANUFACTURER_PART_NUMBER: XFL4020-222MEC; MOUSER_PART_NUMBER: 994-XFL4020-222MEC; MOUSER_PRICE-STOCK: https://www.mouser.co.uk/ProductDetail/Coilcraft/XFL4020-222MEC?qs=zCSbvcPd3pbe5jEAG1ZkEA%3D%3D
M1 M2 M5 = HSFL_Main_Library:BSC014N04LSI
M3 M4 M7 = HSFL_Main_Library:BSC093N04LS51
R1-R4 R27 = HSFL_Main_Library:KRL2012E-M-R004-F-T5: Current Sense Resistors - SMD 1W 4m ohm 1% Source: Datasheet <http://www.mouser.com/datasheet/2/392/n_catalog_partition19_en-1114600.pdf>; ARROW_PART_NUMBER: KRL2012E-M-R004-F-T5; DESCRIPTION: Current Sense Resistors - SMD 1W 4m ohm 1%; HEIGHT: 0.7mm; MANUFACTURER_NAME: Susumu; MANUFACTURER_PART_NUMBER: KRL2012E-M-R004-F-T5; MOUSER_PART_NUMBER: 754-KRL2012EMR004FT5; MOUSER_PRICE-STOCK: https://www.mouser.co.uk/ProductDetail/Susumu/KRL2012E-M-R004-F-T5?qs=B%2FFHBzrwtkb3dg3io6EAYQ%3D%3D
R5-R26 R28-R42 R45-R48 R51-R61 = HSFL_Main_Library:RESISTOR: Resistor Basic schematic elements and footprints for 0603, 1206, and PTH resistors.
R99 = HSFL_Main_Library:CRCW20100000Z0EF: THICK FILM CHIP RESISTOR; ARROW_ELECTRONICS-PURCHASE-URL: https://snapeda.com/shop?store=Arrow+Electronics&id=217989; DESCRIPTION: 0 Ohms Jumper 0.75W, 3/4W Chip Resistor 2010 (5025 Metric) Automotive AEC-Q200 Thick Film; DIGI-KEY_PART_NUMBER: 541-0.0WCT-ND; MF: Vishay Dale; MOUSER-PURCHASE-URL: https://snapeda.com/shop?store=Mouser&id=217989; MP: CRCW20100000Z0EF; PACKAGE: 5025 Vishay
TB1 = HSFL_Main_Library:ARDUINO_NANO: Arduino Nano, Through Hole; AVAILABILITY: Unavailable; DESCRIPTION: ATmega4809 Arduino Nano Every with Headers AVR® AVR MCU 8-Bit Embedded Evaluation Board; MF: Arduino; MP: ARDUINO NANO; PACKAGE: None; PRICE: None
U1 = HSFL_Main_Library:LT8390EFE
U2 = HSFL_Main_Library:TCA9511A
U3-U5 = HSFL_Main_Library:LT8609A
U6-U10 = HSFL_Main_Library:LTC1477
U11 = HSFL_Main_Library:ADT7311: The ADT7311 is a high accuracy digital temperature sensor in a narrow 8-lead SOIC package. It contains a band gap temperature reference and a 16-bit ADC to monitor and digitize the temperature to a 0.0078°C resolution. The ADC resolution, by default, is set to 13 bits (0.0625°C). The ADC resolution is a user programmable mode that can be changed through the serial interface. br> The ADT7311 is guaranteed to operate over supply voltages from 2.7 V to 5.5 V. Operating at 3.3 V, the average supply current is typically 210 μA. The ADT7311 has a shutdown mode that powers down the device and offers a shutdown current of typically 2 μA. The ADT7311 is rated for operation over the −40°C to +150°C temperature range. br> The CT pin is an open-drain output that becomes active when the temperature exceeds a programmable critical temperature limit. The default critical temperature limit is 147°C. The INT pin is also an open-drain output that becomes active when the temperature exceeds a programmable limit. The INT and CT pins can operate in either comparator or interrupt mode.
U12 = HSFL_Main_Library:MAX16998AAUA+; BUILT_BY: EMA_UL_Team; MANUFACTURER_PART_NUMBER: MAX16998AAUA+; SOURCELIBRARY: Maxim_2014-05-21; VENDOR: Maxim Integrated Products
U13 = HSFL_Main_Library:TPS27082LDDCR; COMPTYPE: IC; MANUFACTURER: Texas Instruments; MOUNTTYPE: SMT; PACKAGEREFERENCE: DDC0006A; PARTNUMBER: TPS27082LDDC; PIN_COUNT: 6; REFDES: RefDes; ROHS: Y; TYPE: TYPE